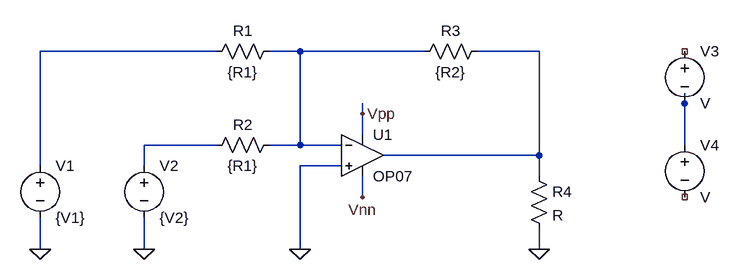
[diagram p0: schematic Draft3.asc]
Draft3.asc, the LTspice schematic file:
Version 4.1
SHEET 1 984 680
WIRE 208 -128 -64 -128
WIRE 336 -128 288 -128
WIRE 528 -128 336 -128
WIRE 704 -128 608 -128
WIRE 928 -48 928 -64
WIRE 432 -32 432 -48
WIRE 432 0 432 -32
WIRE 208 16 96 16
WIRE 336 16 336 -128
WIRE 336 16 288 16
WIRE 400 16 336 16
WIRE 928 16 928 -48
WIRE 704 32 704 -128
WIRE 704 32 464 32
WIRE -64 48 -64 -128
WIRE 96 48 96 16
WIRE 400 48 336 48
WIRE 704 64 704 32
WIRE 432 96 432 64
WIRE -64 176 -64 128
WIRE 96 176 96 128
WIRE 336 176 336 48
WIRE 704 176 704 144
FLAG -64 176 0
FLAG 96 176 0
FLAG 336 176 0
FLAG 432 -32 Vpp
FLAG 432 96 Vnn
FLAG 704 176 0
SYMBOL voltage -64 32 R0
WINDOW 123 0 0 Left 0
WINDOW 39 0 0 Left 0
SYMATTR InstName V1
SYMATTR Value {V1}
SYMBOL voltage 96 32 R0
SYMATTR InstName V2
SYMATTR Value {V2}
SYMBOL res 304 -144 R90
WINDOW 0 0 56 VBottom 2
WINDOW 3 32 56 VTop 2
SYMATTR InstName R1
SYMATTR Value {R1}
SYMBOL res 304 0 R90
WINDOW 0 0 56 VBottom 2
WINDOW 3 32 56 VTop 2
SYMATTR InstName R2
SYMATTR Value {R1}
SYMBOL OpAmps\\OP07 432 -32 R0
SYMATTR InstName U1
SYMBOL res 624 -144 R90
WINDOW 0 0 56 VBottom 2
WINDOW 3 32 56 VTop 2
SYMATTR InstName R3
SYMATTR Value {R2}
SYMBOL res 688 48 R0
SYMATTR InstName R4
SYMBOL voltage 928 -144 R0
SYMATTR InstName V3
SYMBOL voltage 928 0 R0
SYMATTR InstName V4

The netlist it stands for:
* Draft3.asc
V1 N001 0 {V1}
V2 N005 0 {V2}
R1 N002 N001 {R1}
R2 N002 N005 {R1}
X§U1 0 N002 Vpp Vnn N003 LT1001  ; OP07, pins In+ In- V+ V- OUT
R3 N003 N002 {R2}
R4 N003 0 R
V3 NC_01 N004 V
V4 N004 NC_02 V
.lib LTC.lib
.backanno
.end